# EAGLE design Adafruit PWM Servo Shield (EAGLE 6.3)
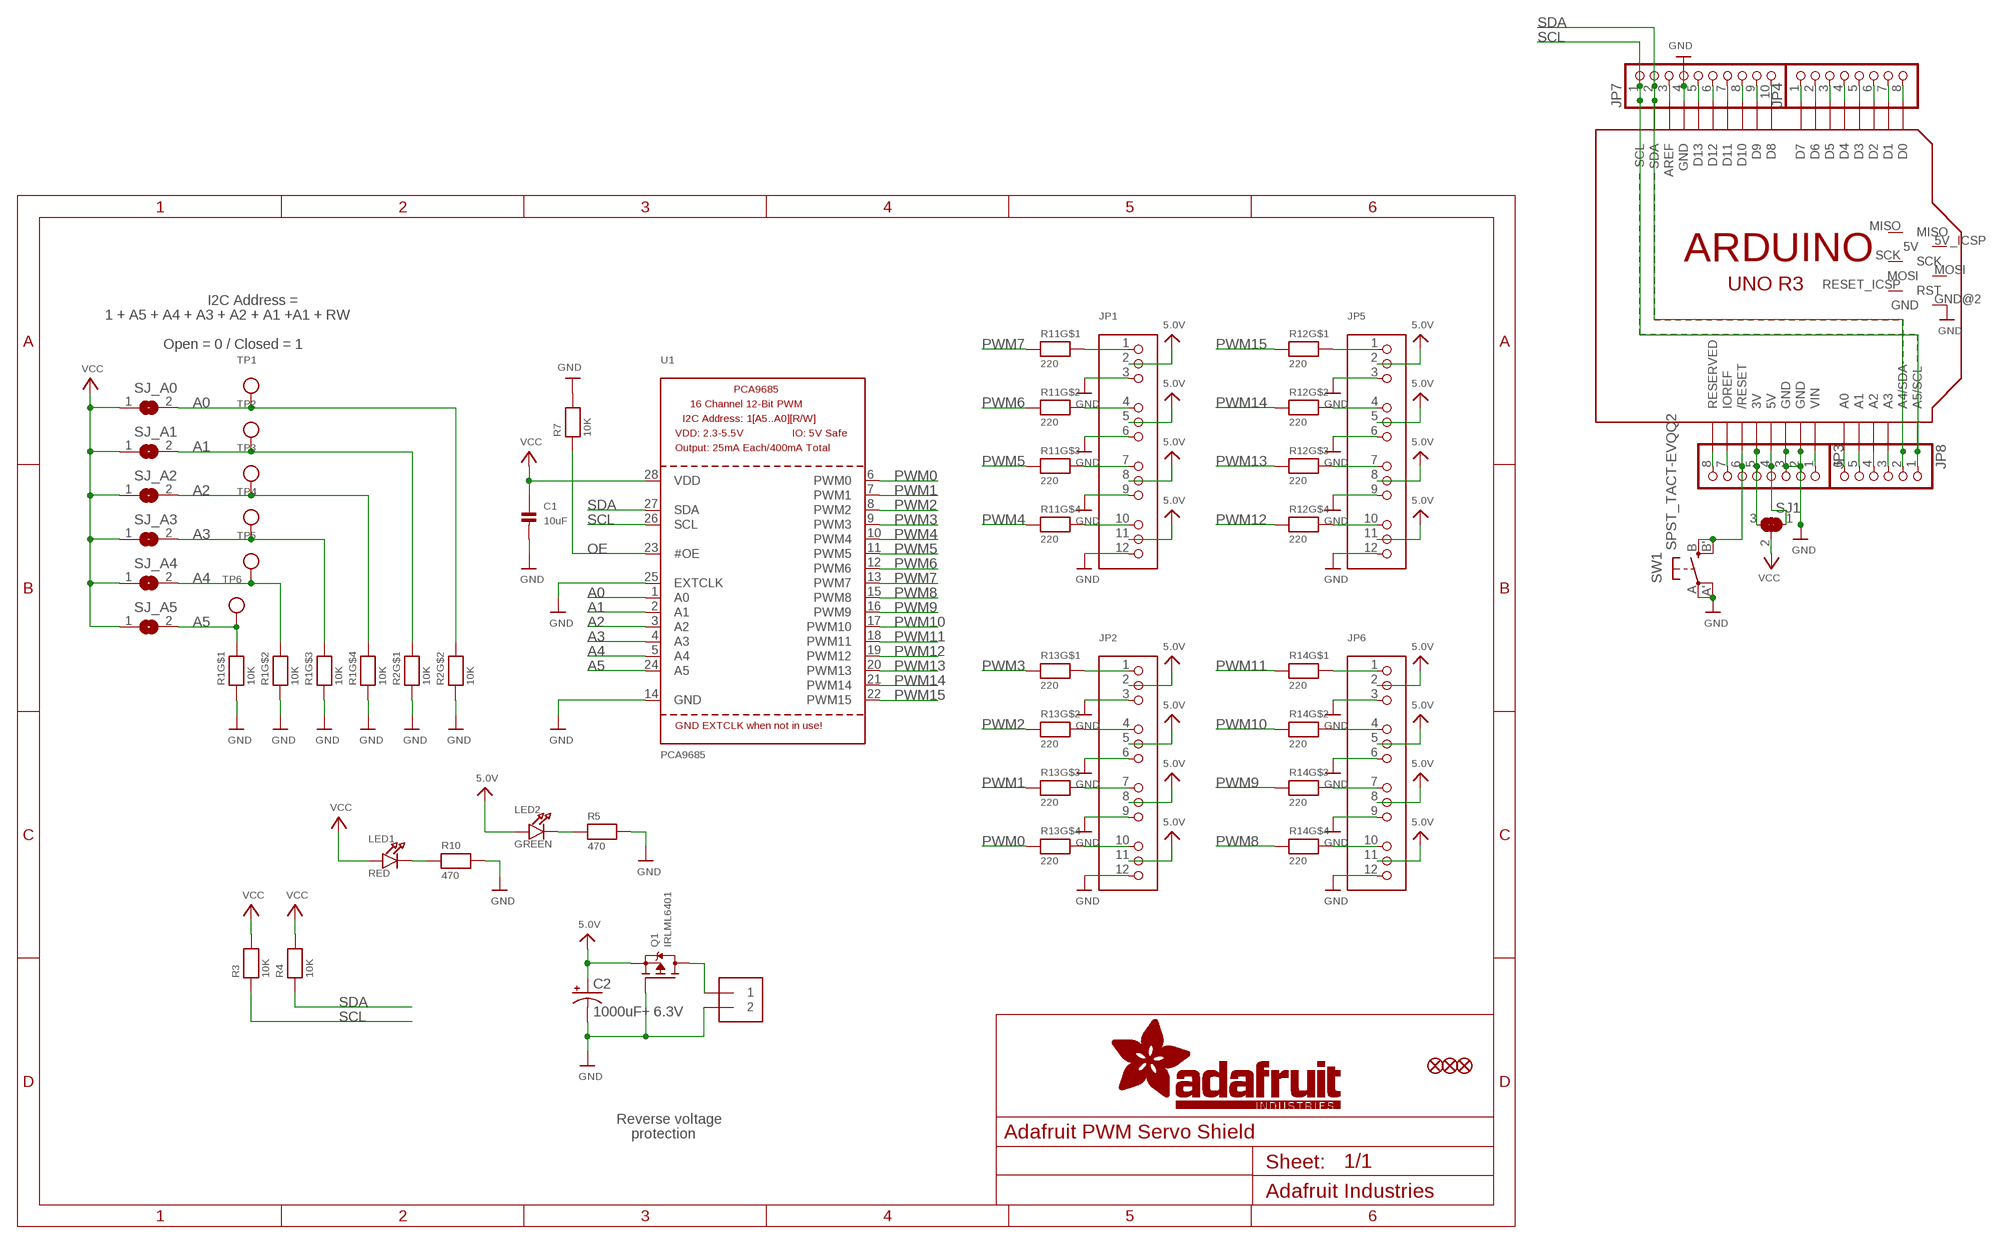
[diagram p0: schematic, sheet 1]

## Parts
C1  10uF  CAP_CERAMIC0805  [0805]
C2  1000uF+ 6.3V  CPOL-USE3.5-10  [E3,5-10]
FID1  FIDUCIAL""  [FIDUCIAL_1MM]
FID2  FIDUCIAL""  [FIDUCIAL_1MM]
FID3  FIDUCIAL""  [FIDUCIAL_1MM]
J1  TERMBLOCK_1X2-3.5MM  [1X2-3.5MM]
JP1  HEADER-3X04  [3X04]
JP2  HEADER-3X04  [3X04]
JP3  PINHD-1X8CLEANBIG  [1X08-CLEANBIG]
JP4  PINHD-1X8CLEANBIG  [1X08-CLEANBIG]
JP5  HEADER-3X04  [3X04]
JP6  HEADER-3X04  [3X04]
JP7  HEADER-1X1070MIL  [1X10_ROUND70]
JP8  PINHD-1X6CB  [1X06-CLEANBIG]
LED1  RED  LED0805  [CHIPLED_0805]
LED2  GREEN  LED0805  [CHIPLED_0805]
Q1  IRLML6401  MOSFET-PWIDE  [SOT23-WIDE]
R1  10K  RESISTOR_4PACK  [RESPACK_4X0603]
R2  10K  RESISTOR_4PACK  [RESPACK_4X0603]
R3  10K  RESISTOR0805  [0805]
R4  10K  RESISTOR0805  [0805]
R5  470  RESISTOR0805  [0805]
R7  10K  RESISTOR0805  [0805]
R10  470  RESISTOR0805  [0805]
R11  220  RESISTOR_4PACK  [RESPACK_4X0603]
R12  220  RESISTOR_4PACK  [RESPACK_4X0603]
R13  220  RESISTOR_4PACK  [RESPACK_4X0603]
R14  220  RESISTOR_4PACK  [RESPACK_4X0603]
SJ1  SOLDERJUMPER_2WAY  [SOLDERJUMPER_2WAY_OPEN_NOPASTE]
SJ_A0  SOLDERJUMPERREFLOW_NOPASTE  [SOLDERJUMPER_REFLOW_NOPASTE]
SJ_A1  SOLDERJUMPERREFLOW_NOPASTE  [SOLDERJUMPER_REFLOW_NOPASTE]
SJ_A2  SOLDERJUMPERREFLOW_NOPASTE  [SOLDERJUMPER_REFLOW_NOPASTE]
SJ_A3  SOLDERJUMPERREFLOW_NOPASTE  [SOLDERJUMPER_REFLOW_NOPASTE]
SJ_A4  SOLDERJUMPERREFLOW_NOPASTE  [SOLDERJUMPER_REFLOW_NOPASTE]
SJ_A5  SOLDERJUMPERREFLOW_NOPASTE  [SOLDERJUMPER_REFLOW_NOPASTE]
SW1  SPST_TACT-EVQQ2  [EVQ-Q2]
TP1  TESTPOINTROUND2MM  [TESTPOINT_ROUND_2MM]
TP2  TESTPOINTROUND2MM  [TESTPOINT_ROUND_2MM]
TP3  TESTPOINTROUND2MM  [TESTPOINT_ROUND_2MM]
TP4  TESTPOINTROUND2MM  [TESTPOINT_ROUND_2MM]
TP5  TESTPOINTROUND2MM  [TESTPOINT_ROUND_2MM]
TP6  TESTPOINTROUND2MM  [TESTPOINT_ROUND_2MM]
U1  PCA9685  [TSSOP28]
U$44  ARDUINO_R3_ICSP  [ARDUINOR3_ICSP]

## Nets
5.0V: C2.+ JP1.2 JP1.5 JP1.8 JP1.11 JP2.2 JP2.5 JP2.8 JP2.11 JP5.2 JP5.5 JP5.8 JP5.11 JP6.2 JP6.5 JP6.8 JP6.11 LED2.A Q1.2(S)
A0: R2.7 SJ_A0.2 TP1.P$1 U1.1(A0)
A1: R2.8 SJ_A1.2 TP2.P$1 U1.2(A1)
A2: R1.5 SJ_A2.2 TP3.P$1 U1.3(A2)
A3: R1.6 SJ_A3.2 TP4.P$1 U1.4(A3)
A4: R1.7 SJ_A4.2 TP5.P$1 U1.5(A4)
A5: R1.8 SJ_A5.2 TP6.P$1 U1.24(A5)
GND: C1.2 C2.- J1.2 JP1.3 JP1.6 JP1.9 JP1.12 JP2.3 JP2.6 JP2.9 JP2.12 JP3.2 JP3.3 JP5.3 JP5.6 JP5.9 JP5.12 JP6.3 JP6.6 JP6.9 JP6.12 JP7.4 Q1.1(G) R1.1 R1.2 R1.3 R1.4 R2.1 R2.2 R5.2 R7.2 R10.2 SW1.A'(P1) SW1.A(P) U1.14(GND) U1.25(EXTCLK) U$44.GND U$44.GND@1(GND) U$44.GND@2(GND) U$44.GND@3(GND)
N$1: LED1.C R10.1
N$2: JP1.4 R11.7
N$3: JP1.1 R11.8
N$4: JP1.7 R11.6
N$5: JP1.10 R11.5
N$6: JP2.1 R13.8
N$7: JP2.4 R13.7
N$8: JP2.7 R13.6
N$9: JP2.10 R13.5
N$10: JP6.10 R14.5
N$11: JP6.7 R14.6
N$12: JP6.4 R14.7
N$13: JP6.1 R14.8
N$14: JP5.10 R12.5
N$15: JP5.7 R12.6
N$16: JP5.4 R12.7
N$17: JP5.1 R12.8
N$18: JP3.1 U$44.VIN
N$19: LED2.C R5.1
N$22: JP3.5 SJ1.3 U$44.3V
N$23: JP3.4 SJ1.1 U$44.5V
N$24: JP3.7 U$44.IOREF
N$25: JP3.8 U$44.RESERVED
N$26: JP4.1 U$44.D7
N$27: JP4.2 U$44.D6
N$28: JP4.3 U$44.D5
N$29: JP4.4 U$44.D4
N$30: JP4.5 U$44.D3
N$31: JP4.6 U$44.D2
N$32: JP4.7 U$44.D1
N$33: JP4.8 U$44.D0
N$36: JP7.3 U$44.AREF
N$38: JP7.5 U$44.D13
N$39: JP7.6 U$44.D12
N$40: JP7.7 U$44.D11
N$41: JP7.8 U$44.D10
N$42: JP7.9 U$44.D9
N$43: JP7.10 U$44.D8
N$46: JP8.3 U$44.A3
N$47: JP8.4 U$44.A2
N$48: JP8.5 U$44.A1
N$49: JP8.6 U$44.A0
N$139: JP3.6 SW1.B'(S1) SW1.B(S) U$44.RESET(/RESET)
OE: R7.1 U1.23(#OE)
PWM0: R13.4 U1.6(PWM0)
PWM1: R13.3 U1.7(PWM1)
PWM2: R13.2 U1.8(PWM2)
PWM3: R13.1 U1.9(PWM3)
PWM4: R11.4 U1.10(PWM4)
PWM5: R11.3 U1.11(PWM5)
PWM6: R11.2 U1.12(PWM6)
PWM7: R11.1 U1.13(PWM7)
PWM8: R14.4 U1.15(PWM8)
PWM9: R14.3 U1.16(PWM9)
PWM10: R14.2 U1.17(PWM10)
PWM11: R14.1 U1.18(PWM11)
PWM12: R12.4 U1.19(PWM12)
PWM13: R12.3 U1.20(PWM13)
PWM14: R12.2 U1.21(PWM14)
PWM15: R12.1 U1.22(PWM15)
PWRIN: J1.1 Q1.3(D)
SCL: JP7.1 JP8.1 R3.1 U1.26(SCL) U$44.A5(A5/SCL) U$44.SCL
SDA: JP7.2 JP8.2 R4.1 U1.27(SDA) U$44.A4(A4/SDA) U$44.SDA
VCC: C1.1 LED1.A R3.2 R4.2 SJ1.2 SJ_A0.1 SJ_A1.1 SJ_A2.1 SJ_A3.1 SJ_A4.1 SJ_A5.1 U1.28(VDD)
Unconnected: R2.3 R2.4 R2.5 R2.6 U$44.5V_ICSP(5V) U$44.MISO U$44.MOSI U$44.RESET_ICSP(RST) U$44.SCK

## Notes on the sheet
- I2C Address =
- 1 + A5 + A4 + A3 + A2 + A1 +A1 + RW
- Open = 0 / Closed = 1
- Reverse voltage
- protection

## Library data of the parts
C1 = microbuilder:CAP_CERAMIC: Ceramic Capacitors 0402 - 0402 Surface Mount Capacitors 16pF 50V 5% [Digikey: 445-4899-2-ND] 18pF 50V 5% [Digikey: 490-1281-2-ND] 22pF 50V 5% [Digikey: 490-1283-2-ND] 68pF 50V 5% [Digikey: 490-1289-2-ND] 0.1uF 10V 10% [Digikey: 490-1318-2-ND] 1.0uF 6.3V 10% [Digikey: 490-1320-2-ND] 0603 - 0603 Surface Mount Capacitors 16 pF 50V 5% [Digikey: 445-5051-2-ND] 22 pF 50V [Digikey: PCC220ACVTR-ND] 33 pF 50V 5% [Digikey: 490-1415-1-ND] 56pF 50V 5% [Digikey: 490-1421-1-ND] 220pF 50V 5% [Digikey: 445-1285-1-ND] 680 pF 50V 2200 pF 50V 5% C0G [Digikey: 445-1297-1-ND] 5600 pF 100V 5% X7R [Digikey: 478-3711-1-ND] 0.1 µF 25V 10% [Digikey: PCC2277TR-ND] 0.22 µF 16V 10% X7R [Digikey: 445-1318-1-ND] 1.0 µF 25V 10% [Digikey: 445-5146-2-ND] 0603 - RF Specific 3pF 250V +/-0.1pF RF [Digikey: 712-1347-1-ND] 18 pF 250V 5% [Digikey: 478-3505-1-ND or 712-1322-1-ND] 56 pF 250V 5% C0G RF [Digikey: 490-4867-1-ND] 68 pF 250V RF [Digikey: 490-4868-1-ND] 0805 - 0805 Surface Mount Capacitors 220 pF 250V 2% RF Ceramic Capacitor [Digikey: 712-1398-1-ND] 1000 pF 50V 2% NP0 Ceramic Capacitor [Digikey: 478-3760-1-ND] 0.1 µF 25V 10% Ceramic Capacitor [Digikey: PCC1828TR-ND] 1.0 µF 16V 10% Ceramic Capacitor[Digikey: 490-1691-2-ND] 10.0 µF 10V 10% Ceramic Capacitor[Digikey: 709-1228-1-ND] 10.0 uF 16V 10% Ceramic Capacitor [Digikey: 478-5165-2-ND] 47 uF 6.3V 20% Ceramic Capacitor [Digikey: 587-1779-1-ND or 399-5506-1-ND] 1206 - 1206 Surface Mount Capacitors 47uF 10V 20% Ceramic Capacitor [Digikey: 490-5528-1-ND or 399-5508-1-ND or 445-6010-1-ND] 100uF 6.3V -20%, +80% Y5V Ceramic Capacitor (Digikey: 490-4512-1-ND, Mouser: 81-GRM31CF50J107ZE1L)
C2 = adafruit:CPOL-US: POLARIZED CAPACITOR, American symbol
FID1-FID3 = microbuilder:FIDUCIAL: Fiducial Alignment Points Various fiducial points for machine vision alignment.
J1 = microbuilder:TERMBLOCK_1X2: 3.5mm Terminal block http://www.ladyada.net/library/pcb/eaglelibrary.html
JP1 JP2 JP5 JP6 = microbuilder:HEADER-3X04
JP3 JP4 = adafruit:PINHD-1X8: PIN HEADER
JP7 = microbuilder:HEADER-1X10: PIN HEADER
JP8 = adafruit:PINHD-1X6: PIN HEADER
LED1 LED2 = microbuilder:LED: LED 0603 - 0603 Surface Mount Package 2mA: Green LED - Low Power (3.9mcd, 2ma, 1.7Vf) - Digikey: 475-2709-2-ND Orange LED - Low Power (9.8mcd, 2ma, 1.8Vf) - Digikey: 475-1194-2-ND Red LED - Low Power (5mcd, 2ma, 1.8Vf) - Digikey: 475-1195-2-ND Yellow LED - Low Power (7mcd, 2ma, 1.8Vf) - Digikey: 475-1196-2-ND 5mA: Blue LED - Low Power (17mcd, 5ma, 2.9Vf) - Digikey: LNJ937W8CRACT-ND 0805 - 0805 Surface Mount Package 2mA: Red LED (8.8mcd, 2mA, 1.8Vf, Clear) - Low Power [Digikey: 475-2510-1-ND] Green LED (5mcd, 2mA, 1.8Vf, Clear) - Low Power [Digikey: 475-2730-1-ND] Yellow LED (11.3mcd, 2mA, 1.8Vf, Clear) - Low Power [Digikey: 475-2555-1-ND] 20mA: Red LED (104mcd, 20mA, Diffused) - LS R976 [Digikey: 475-1278-6-ND] Red LED (12mcd, 20mA, 2.0Vf, Clear) - APT2012EC [Digikey: 754-1128-1-ND] Green LED (15mcd, 20mA, 2.2Vf, Clear) - APT2012GC [Digikey: 754-1131-1-ND] Orange LED (160mcd, 20mA, 2.1Vf, Clear) - APT2012SECK [Digikey: 754-1130-1-ND] 1206 - 1206 Surface Mount Package Green LED (26mcd, 20mA, Diffused) - LG N971 [Digikey: 475-1407-6-ND] Red LED (15mcd, 20mA, Diffused) - LH N974 [Digikey: 475-1416-6-ND]
Q1 = microbuilder:MOSFET-P: P-Channel Mosfet LEGEND VDS: Voltage Drain-Source ID: Drain Current RDS(ON): Drain-Source On-State Resistance VGS(TH): Gate-Source Threshold Voltage CISS: Drain-Source Input Capacitance SOT-23 Name VDS ID RDS(ON) VGS(TH) CISS Order Number IRLML5103 30V 760mA 600 mOhm -- 75pF @ 25V Digikey: IRLML5103PBFCT-ND NTR0202PL 20V 400mA 800 mOhm 2.3V @ 250uA 70pF @ 5V Digikey: NTR0202PLT1GOSTR-ND NTR4101PT1G 20V 1.8A 85 mOhm 1.2V @ 250uA 675pF @ 10V Digikey: NTR4101PT1GOSCT-ND DMP2004K 20V 600mA 900 mOhm 1V @ 250uA 175pF @ 16V Digikey: DMP2004KDICT-ND PMV65XP 20V 3.9A 76 mOhm 950mV @ 1mA 725pF @ 20V Digikey: 568-2358-2-ND TO-252 Name VDS ID RDS(ON) VGS(TH) CISS Order Number AOD417 30V 25A 34 mOhm 3V @ 250µA 920pF @ 15V Digikey: 785-1106-2-ND
R1 R2 R11-R14 = microbuilder:RESISTOR_4PACK: Resistor Packs (4 resistors) 4 x 0603 10K 1/16W - Digikey: YC164J-10KCT-ND
R3-R5 R7 R10 = microbuilder:RESISTOR: Resistors 0402 - 0402 Surface Mount Package 22 Ohm 1% 1/16W [Digikey: 311-22.0LRTR-ND] 33 Ohm 5% 1/16W 1.0K 5% 1/16W 1.5K 5% 1/16W 2.0K 1% 1/16W 10.0K 1% 1/16W [Digikey: 311-10.0KLRTR-ND] 10.0K 5% 1/16W [Digikey: RMCF0402JT10K0TR-ND] 12.1K 1% 1/16W [Digikey: 311-22.0LRTR-ND] 100.0K 5% 1/16W 0603 - 0603 Surface Mount Package 0 Ohm 1/10 Watt 1% Resistor 15 Ohm 1/10 Watt 1% Resistor 33 Ohm 1/10 Watt 1% Resistor 49.9 Ohm 1/10 Watt 1% Resistor 100 Ohm 1/10 Watt 1% Resistor 150 Ohm 1/10 Watt 1% Resistor 240 Ohm 1/10 Watt 1% Resistor 390 Ohm 1/10 Watt 1% Resistor 560 Ohm 1/10 Watt 1% Resistor 680 Ohm 1/10 Watt 1% Resistor 750 Ohm 1/10 Watt 1% Resistor 1.0K Ohm 1/10 Watt 1% Resistor 1.5K Ohm 1/10 Watt 1% Resistor 2.0K Ohm 1/10 Watt 1% Resistor 2.2K Ohm 1/10 Watt 1% Resistor 3.3K Ohm 1/10 Watt 1% Resistor 4.7K Ohm 1/10 Watt 1% Resistor 10.0K Ohm 1/10 Watt 1% Resistor 12.0K Ohm 1/10 Watt 1% Resistor 12.1K Ohm 1/10 Watt 1% Resistor 20.0K Ohm 1/10 Watt 1% Resistor 33.0K Ohm 1/10 Watt 1% Resistor 100.0K Ohm 1/10 Watt 1% Resistor 0805 - 0805 Surface Mount Package 0 Ohm 1/8 Watt 1% Resistor 33 Ohm 1/8 Watt 1% Resistor 100 Ohm 1/8 Watt 1% Resistor 150 Ohm 1/8 Watt 1% Resistor 200 Ohm 1/8 Watt 1% Resistor 240 Ohm 1/8 Watt 1% Resistor 330 Ohm 1/8 Watt 1% Resistor 390 Ohm 1/8 Watt 1% Resistor 470 Ohm 1/8 Watt 1% Resistor 1.0K Ohm 1/8 Watt 1% Resistor 1.5K Ohm 1/8 Watt 1% Resistor 2.0K Ohm 1/8 Watt 1% Resistor 4.7K Ohm 1/8 Watt 1% Resistor 5.1K Ohm 1/8 Watt 1% Resistor 5.6K Ohm 1/8 Watt 1% Resistor 10.0K Ohm 1/8 Watt 1% Resistor 22.0K Ohm 1/8 Watt 1% Resistor 33.0K Ohm 1/8 Watt 1% Resistor 100K Ohm 1/8 Watt 1% Resistor 1206 - 1206 Surface Mount Package 2012 - 2010 Surface Mount Package 0.11 Ohm 1/2 Watt 1% Resistor - Digikey: RHM.11UCT-ND
SJ1 = microbuilder:SOLDERJUMPER_2WAY: 2-Way Solder Jumper
SJ_A0 SJ_A1-SJ_A5 = microbuilder:SOLDERJUMPER: SMD Solder JUMPER Solder the two pads together to create a connection, or remove the solder to break it. REFLOW - Use this footprint for solder paste and reflow ovens. WAVE - Use this footprint for hand-soldering (larger pads). CLOSED - Has a trace between the two pads to ensure it is closed by default. The trace needs to be cut to disable the jumper, and can be closed again by creating a solder bridge between the two pads.
SW1 = adafruit:SPST_TACT: SMT 6mm switch, EVQQ2 series http://www.ladyada.net/library/eagle
TP1-TP6 = microbuilder:TESTPOINT: Test Point Various test points for characterisation and PCB testing TESTPOINT_SMT - Compact Surface Mount Test Point [Digikey: 5016KTR-ND]
U1 = microbuilder:PCA9685: PCA9685 - 16 Channel 12-Bit I2C PWM Controller 5.0V tolerant 16 channel, 12-bit I2C PWM controller with 25mA per output (max. 400mA total) Digikey: 568-5931-1-ND
U$44 = adafruit:ARDUINO_R3_ICSP

## Board
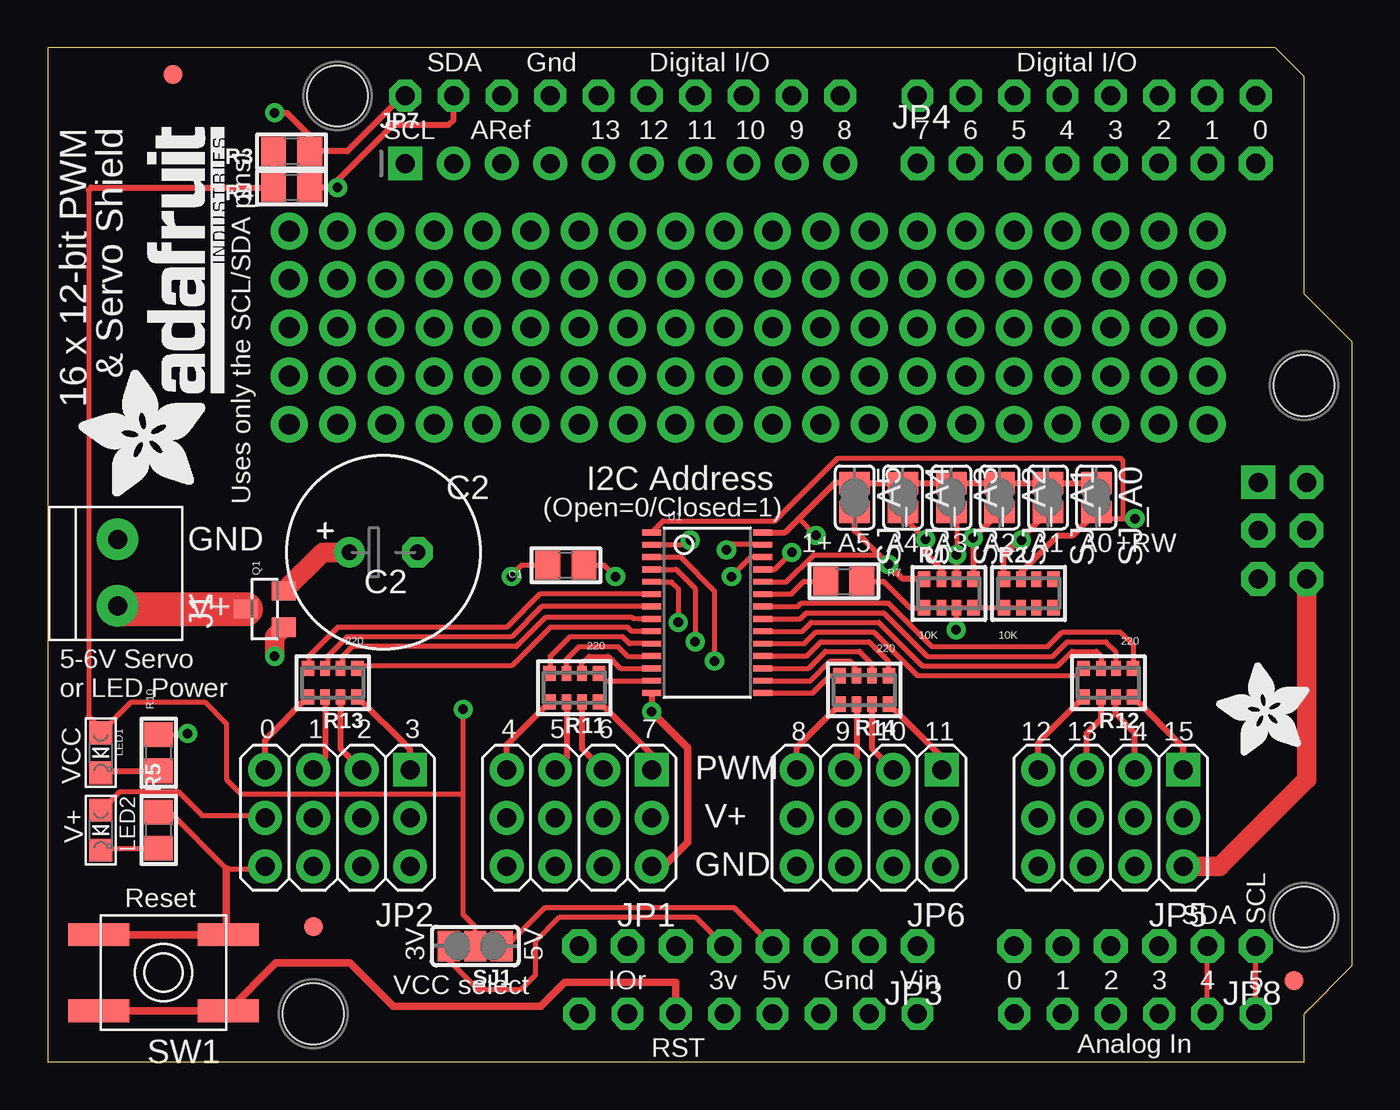
[diagram p1: board, top side]
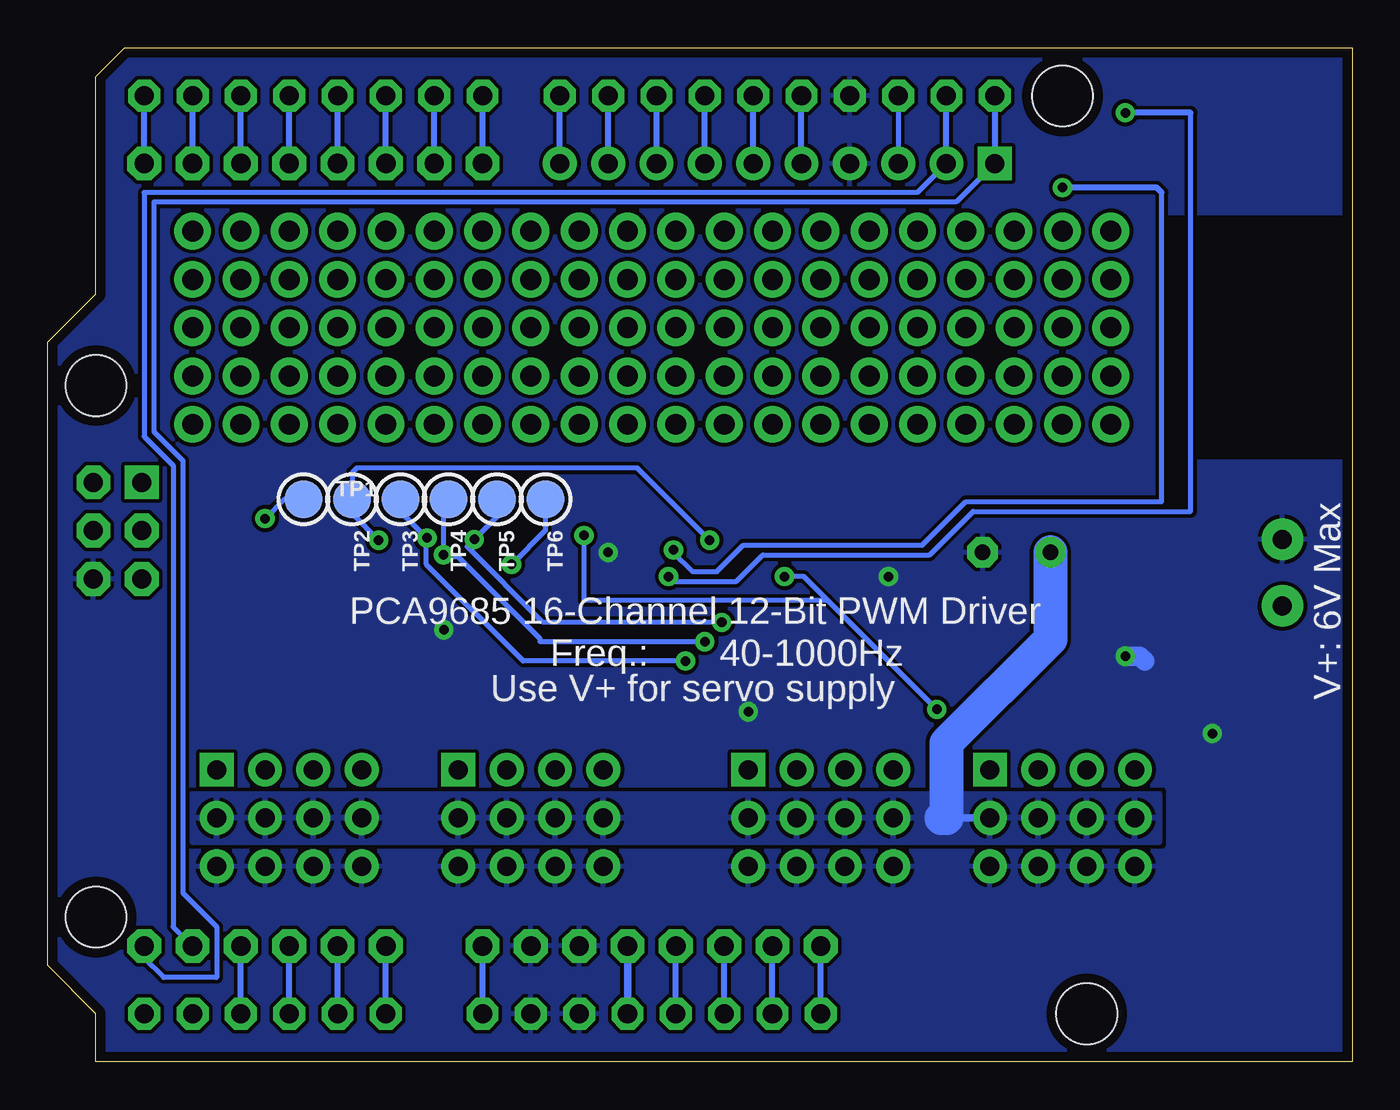
[diagram p2: board, bottom side, seen from below]

Size 68.58 x 53.34 mm. Coordinates in mm from the lower left corner, seen from the top.
Copper layers (1*16): Top 0.035mm / dielectric 1.5mm / Bottom 0.035mm
Design rules "PCBCart-Standard *": minimum track width 8mil, minimum drill 0.4mm, track to track 8mil, track to pad 8mil, pad to pad 8mil, via to via 8mil, smd to smd 8mil, copper to edge 20mil, drill to drill 8mil, minimum pad ring 8mil, minimum via ring 10mil, stop-mask expansion 3mil, vias tented up to drill 20mil, thermal gap 8mil
Holes 3.2 mm at 15.24,50.8 66.04,35.56 66.04,7.62 13.97,2.54

### Footprints (pad centres in the part's own frame; a part is rotated, then mirrored left to right if it is on the bottom)
0805 = smd 1.3 x 1.5: 1 -0.95,0; 2 0.95,0
E3,5-10 = drill 0.813 pad 1.6: + -1.778,0 | drill 0.813 pad 1.6 octagon: - 1.778,0
FIDUCIAL_1MM = smd 1 x 1: 1 0,0
1X2-3.5MM = drill 1 pad 2.184: 1 1.8,0; 2 -1.7,0
3X04 = drill 1 pad 1.778 square: 1 -3.81,-2.54 | drill 1 pad 1.778: 2 -3.81,0; 3 -3.81,2.54; 4 -1.27,-2.54; 5 -1.27,0; 6 -1.27,2.54; 7 1.27,-2.54; 8 1.27,0; 9 1.27,2.54; 10 3.81,-2.54; 11 3.81,0; 12 3.81,2.54
1X08-CLEANBIG = drill 1.016 pad 1.778 octagon: 1 -8.89,0; 2 -6.35,0; 3 -3.81,0; 4 -1.27,0; 5 1.27,0; 6 3.81,0; 7 6.35,0; 8 8.89,0
1X10_ROUND70 = drill 1 pad 1.778 square: 1 -11.43,0 | drill 1 pad 1.778: 2 -8.89,0; 3 -6.35,0; 4 -3.81,0; 5 -1.27,0; 6 1.27,0; 7 3.81,0; 8 6.35,0; 9 8.89,0; 10 11.43,0
1X06-CLEANBIG = drill 1.016 pad 1.778 octagon: 1 -6.35,0; 2 -3.81,0; 3 -1.27,0; 4 1.27,0; 5 3.81,0; 6 6.35,0
CHIPLED_0805 = smd 1.2 x 1.2: A 0,-1.05; C 0,1.05
SOT23-WIDE = smd 1 x 1.27: 1 -0.95,-1; 2 0.95,-1; 3 0,1
RESPACK_4X0603 = smd 0.65 x 0.8: 1 -1.3,-0.75; 4 1.3,-0.75; 5 1.3,0.75; 8 -1.3,0.75 | smd 0.5 x 0.8: 2 -0.4,-0.75; 3 0.4,-0.75; 6 0.4,0.75; 7 -0.4,0.75
SOLDERJUMPER_2WAY_OPEN_NOPASTE = smd 1.168 x 1.6: 1 -1.397,0; 2 0,0; 3 1.397,0
SOLDERJUMPER_REFLOW_NOPASTE = smd 1.168 x 1.6: 1 -0.762,0; 2 0.762,0
EVQ-Q2 = smd 3.2 x 1.2: A -3.4,-2; A' 3.4,-2; B -3.4,2; B' 3.4,2
TESTPOINT_ROUND_2MM = smd 2 x 2: P$1 0,0
TSSOP28 = smd 0.305 x 0.991: 1 -4.225,-2.918; 2 -3.575,-2.918; 3 -2.925,-2.918; 4 -2.275,-2.918; 5 -1.625,-2.918; 6 -0.975,-2.918; 7 -0.325,-2.918; 8 0.325,-2.918; 9 0.975,-2.918; 10 1.625,-2.918; 11 2.275,-2.918; 12 2.925,-2.918; 13 3.575,-2.918; 14 4.225,-2.918; 15 4.225,2.918; 16 3.575,2.918; 17 2.925,2.918; 18 2.275,2.918; 19 1.625,2.918; 20 0.975,2.918; 21 0.325,2.918; 22 -0.325,2.918; 23 -0.975,2.918; 24 -1.625,2.918; 25 -2.275,2.918; 26 -2.925,2.918; 27 -3.575,2.918; 28 -4.225,2.918
ARDUINOR3_ICSP = drill 1 pad 1.676 octagon: 3V 35.56,2.54; 5V 38.1,2.54; A0 50.8,2.54; A1 53.34,2.54; A2 55.88,2.54; A3 58.42,2.54; A4 60.96,2.54; A5 63.5,2.54; AREF 23.876,50.8; D0 63.5,50.8; D1 60.96,50.8; D2 58.42,50.8; D3 55.88,50.8; D4 53.34,50.8; D5 50.8,50.8; D6 48.26,50.8; D7 45.72,50.8; D8 41.656,50.8; D9 39.116,50.8; D10 36.576,50.8; D11 34.036,50.8; D12 31.496,50.8; D13 28.956,50.8; GND 26.416,50.8; GND@1 43.18,2.54; GND@2 40.64,2.54; IOREF 30.48,2.54; RESERVED 27.94,2.54; RESET 33.02,2.54; SCL 18.796,50.8; SDA 21.336,50.8; VIN 45.72,2.54 | drill 1 pad 1.778 octagon: 5V_ICSP 66.167,30.48; GND@3 66.167,25.4; MOSI 66.167,27.94; RESET_ICSP 63.627,25.4; SCK 63.627,27.94 | drill 1 pad 1.778 square: MISO 63.627,30.48

### Placement (x,y rotation side)
C1  27.24,26.11 180 top
C2  17.65,26.8 0 top
FID1  65.52,4.29 0 top
FID2  6.6,51.92 0 top
FID3  13.97,7.11 0 top
J1  3.68,25.78 270 top
JP1  27.94,12.83 180 top
JP2  15.24,12.83 180 top
JP3  36.83,6.1 180 top
JP4  54.61,47.24 0 top
JP5  55.88,12.83 180 top
JP6  43.18,12.83 180 top
JP7  30.23,47.24 0 top
JP8  57.15,6.1 180 top
LED1  2.79,16.26 180 top
LED2  2.79,12.19 180 top
Q1  11.42,23.81 90 top
R1  47.37,24.64 0 top
R2  51.56,24.64 0 top
R3  12.83,47.88 180 top
R4  12.83,45.97 180 top
R5  5.84,12.19 90 top
R7  41.85,25.27 0 top
R10  5.84,16.26 90 top
R11  27.69,19.68 180 top
R12  55.75,19.94 180 top
R13  14.99,19.94 180 top
R14  42.93,19.56 180 top
SJ1  22.48,6.1 180 top
SJ_A0  55.12,29.69 270 top
SJ_A1  52.58,29.69 270 top
SJ_A2  50.04,29.69 270 top
SJ_A3  47.5,29.69 270 top
SJ_A4  44.96,29.69 270 top
SJ_A5  42.42,29.69 270 top
SW1  6.1,4.7 180 top
TP1  55.12,29.59 0 bottom
TP2  52.58,29.59 270 bottom
TP3  50.04,29.59 270 bottom
TP4  47.5,29.59 270 bottom
TP5  44.96,29.59 270 bottom
TP6  42.42,29.59 270 bottom
U1  34.67,23.62 270 top
U$44  0,0 0 top
U$51  [ADAFRUIT_5MM]  66.29,16.13 90 top
U$54  [ADAFRUIT_TEXT_20MM]  9.27,29.59 90 top

### Tracks (layer width: path | path; a pad name or v marks a point on that pad's centre or on a via)
5.0V
  Top 0.254: LED2.A 2.83,13.24 3.81,14.22 6.86,14.22 8.13,12.95 11.3,12.95 JP2.11
  Top 1.016: Q1.2 14.45,26.8 C2.+
  Bottom 0.406: 21.59,12.83 JP2.2
  Bottom 1.778: C2.+ 15.88,22.23 21.34,16.76 21.34,12.83 21.59,12.83
  pour Bottom: 10.16,14.1 10.16,11.56 60.96,11.56 60.96,14.1
A0  (via drill 0.5)
  Top 0.254: U1.1 32.35,28.45 38.23,28.45 41.53,31.75 56.39,31.75 56.52,31.62 56.52,28.56 | 56.52,28.56 54.75,28.56 | v57.15,28.57 v57.15,28.56 56.52,28.56
  Top 0.305: R2.7 51.16,25.76 53.09,27.69 53.88,27.69 54.75,28.56 SJ_A0.2
  Bottom 0.254: TP1.P$1 56.13,29.59 v57.15,28.57
A1  (via drill 0.5)
  Top 0.254: U1.2 33.51,27.2 33.74,27.43 v33.78,27.43 | 51.29,27.67 51.32,27.67
  Top 0.305: R2.8 50.26,26.64 51.05,27.43 v51.18,27.43 51.32,27.57 51.32,27.67 SJ_A1.2
  Bottom 0.254: v51.18,27.43 52.58,28.83 TP2.P$1 52.58,30.99 52.32,31.24 37.59,31.24 v33.78,27.43
A2  (via drill 0.5)
  Top 0.254: U1.3 33.27,26.55 35.05,24.77 v35.05,21.08
  Top 0.305: R1.5 48.67,27.56 SJ_A2.2 50.01,28.92 v48.64,27.56
  Bottom 0.254: v35.05,21.08 43.59,21.08 48.67,26.16 48.67,27.53 v48.64,27.56 50.04,28.96 TP3.P$1
A3  (via drill 0.5)
  Top 0.254: U1.4 33.03,25.9 34.04,24.89 v34.04,22.1 | SJ_A3.2 47.77,28.65 v47.77,26.67
  Top 0.305: R1.6 v47.77,26.67
  Bottom 0.254: v34.04,22.1 42.69,22.1 42.69,22.24 46.99,26.54 47.64,26.54 v47.77,26.67 47.77,29.32 TP4.P$1
A4  (via drill 0.5)
  Top 0.254: U1.5 32.79,25.25 33.15,24.89 v33.15,23.11 | v46.15,27.48 44.96,28.67 SJ_A4.2
  Top 0.305: 46.97,25.77 R1.7 46.99,25.41 46.99,25.91 46.15,26.75 v46.15,27.48
  Bottom 0.254: v33.15,23.11 42.55,23.11 46.53,27.1 v46.15,27.48 44.96,28.67 TP5.P$1
A5  (via drill 0.5)
  Top 0.254: U1.24 38.84,25.25 40.26,26.67 43.69,26.67
  Top 0.305: SJ_A5.2 42.42,27.94 43.69,26.67 v44.2,26.16 44.93,25.43 46.03,25.43 R1.8
  Bottom 0.254: TP6.P$1 42.42,27.94 v44.2,26.16 44.45,26.16
GND  (via drill 0.5)
  Top 0.254: R5.2 6.42,13.14 9.4,10.16 11.3,10.16 JP2.12 | R10.2 7.3,17.21 v7.37,17.27 | U1.25 38.22,25.9 v39.12,26.8 | 47.75,23.89 R1.2 R1.1 46.06,23.88 45.34,23.88 43.94,25.27 R7.2 | 47.75,23.89 R1.3 R1.4 R2.1 R2.2 | 47.75,23.89 v47.75,22.73 | C1.2 24.89,26.11 24.38,25.61 v24.38,25.53
  Top 0.305: U1.14 v31.75,18.42 v31.75,18.41
  Top 0.406: SW1.A' SW1.A 9.4,6.8 9.4,10.16 | v31.75,18.42 33.66,16.52 33.66,11.56 32.38,10.29 JP1.3
  Top 1.016: Q1.1 11.94,22.38 v11.94,21.34 | U$44.GND@3 66.17,14.86 61.59,10.29 JP5.3
  Bottom 0.254: v7.37,17.27 7.49,17.4 | v31.75,18.41 31.75,18.54 | 47.88,22.99 47.88,22.48
  Bottom 1.016: v11.94,21.34 11.18,21.34 10.92,21.08
  pour Bottom (rank 3): 0,53.09 0,0 69.85,0 69.85,53.09
N$1
  Top 0.305: LED1.C 2.89,15.31 R10.1
N$2
  Top 0.305: R11.7 28.09,16.49 JP1.4
N$3
  Top 0.305: JP1.1 31.75,16.17 R11.8
N$4
  Top 0.305: R11.6 27.29,15.98 JP1.7
N$5
  Top 0.305: JP1.10 24.13,16.68 R11.5
N$6
  Top 0.305: JP2.1 19.05,16.43 R13.8
N$7
  Top 0.305: R13.7 15.39,16.49 JP2.4
N$8
  Top 0.305: R13.6 14.59,15.98 JP2.7
N$9
  Top 0.305: JP2.10 11.43,16.93 R13.5
N$10
  Top 0.305: JP6.10 39.37,16.55 R14.5
N$11
  Top 0.305: R14.6 42.53,15.98 JP6.7
N$12
  Top 0.305: R14.7 43.33,16.49 JP6.4
N$13
  Top 0.305: R14.8 46.99,16.04 JP6.1
N$14
  Top 0.305: JP5.10 52.07,16.81 R12.5
N$15
  Top 0.305: JP5.7 54.61,17.27 55.37,18.03 55.37,19.17 R12.6
N$16
  Top 0.305: JP5.4 57.15,17.27 56.13,18.29 56.13,19.17 R12.7
N$17
  Top 0.305: JP5.1 59.69,16.55 R12.8
N$18
  Bottom 0.305: U$44.VIN JP3.1
N$19
  Top 0.254: LED2.C 2.89,11.24 R5.1
N$20  (via drill 1.1 pad 1.93)
  other vias: 17.78,36.07
N$22
  Top 0.254: SJ1.3 21.08,5.33 22.61,3.81 24.89,3.81 25.65,4.57 25.65,6.35 26.92,7.62 34.04,7.62 JP3.5
  Bottom 0.305: U$44.3V JP3.5
N$23
  Top 0.254: JP3.4 36.07,8.13 26.16,8.13 24.13,6.1 SJ1.1 22.48,6.1
  Bottom 0.406: U$44.5V JP3.4
N$24
  Bottom 0.305: U$44.IOREF JP3.7
N$25
  Bottom 0.305: U$44.RESERVED JP3.8
N$26
  Bottom 0.305: JP4.1 U$44.D7
N$27
  Bottom 0.305: JP4.2 U$44.D6
N$28
  Bottom 0.305: JP4.3 U$44.D5
N$29
  Bottom 0.305: JP4.4 U$44.D4
N$30
  Bottom 0.305: JP4.5 U$44.D3
N$31
  Bottom 0.305: JP4.6 U$44.D2
N$32
  Bottom 0.305: JP4.7 U$44.D1
N$33
  Bottom 0.305: JP4.8 U$44.D0
N$34  (via drill 1.1 pad 1.93)
  other vias: 15.24,33.53
N$35  (via drill 1.1 pad 1.93)
  other vias: 17.78,33.53
N$36
  Bottom 0.254: U$44.AREF JP7.3
N$37  (via drill 1.1 pad 1.93)
  other vias: 17.78,38.61
N$38
  Bottom 0.305: JP7.5 U$44.D13
N$39
  Bottom 0.305: JP7.6 U$44.D12
N$40
  Bottom 0.305: JP7.7 U$44.D11
N$41
  Bottom 0.305: JP7.8 U$44.D10
N$42
  Bottom 0.305: JP7.9 U$44.D9
N$43
  Bottom 0.305: JP7.10 U$44.D8
N$44  (via drill 1.1 pad 1.93)
  other vias: 15.24,36.07
N$45  (via drill 1.1 pad 1.93)
  other vias: 15.24,38.61
N$46
  Bottom 0.305: U$44.A3 JP8.3
N$47
  Bottom 0.305: U$44.A2 JP8.4
N$48
  Bottom 0.305: U$44.A1 JP8.5
N$49
  Bottom 0.305: U$44.A0 JP8.6
N$50  (via drill 1.1 pad 1.93)
  other vias: 15.24,41.15
N$51  (via drill 1.1 pad 1.93)
  other vias: 17.78,41.15
N$52  (via drill 1.1 pad 1.93)
  other vias: 17.78,43.69
N$53  (via drill 1.1 pad 1.93)
  other vias: 15.24,43.69
N$54  (via drill 1.1 pad 1.93)
  other vias: 20.32,43.69
N$55  (via drill 1.1 pad 1.93)
  other vias: 20.32,41.15
N$56  (via drill 1.1 pad 1.93)
  other vias: 20.32,38.61
N$57  (via drill 1.1 pad 1.93)
  other vias: 20.32,36.07
N$58  (via drill 1.1 pad 1.93)
  other vias: 20.32,33.53
N$59  (via drill 1.1 pad 1.93)
  other vias: 22.86,33.53
N$60  (via drill 1.1 pad 1.93)
  other vias: 22.86,36.07
N$61  (via drill 1.1 pad 1.93)
  other vias: 22.86,38.61
N$62  (via drill 1.1 pad 1.93)
  other vias: 22.86,41.15
N$63  (via drill 1.1 pad 1.93)
  other vias: 22.86,43.69
N$64  (via drill 1.1 pad 1.93)
  other vias: 25.4,43.69
N$65  (via drill 1.1 pad 1.93)
  other vias: 25.4,41.15
N$66  (via drill 1.1 pad 1.93)
  other vias: 25.4,38.61
N$67  (via drill 1.1 pad 1.93)
  other vias: 25.4,36.07
N$68  (via drill 1.1 pad 1.93)
  other vias: 25.4,33.53
N$69  (via drill 1.1 pad 1.93)
  other vias: 27.94,33.53
N$70  (via drill 1.1 pad 1.93)
  other vias: 27.94,36.07
N$71  (via drill 1.1 pad 1.93)
  other vias: 27.94,38.61
N$72  (via drill 1.1 pad 1.93)
  other vias: 27.94,41.15
N$73  (via drill 1.1 pad 1.93)
  other vias: 27.94,43.69
N$74  (via drill 1.1 pad 1.93)
  other vias: 30.48,43.69
N$75  (via drill 1.1 pad 1.93)
  other vias: 30.48,41.15
N$76  (via drill 1.1 pad 1.93)
  other vias: 30.48,38.61
N$77  (via drill 1.1 pad 1.93)
  other vias: 30.48,36.07
N$78  (via drill 1.1 pad 1.93)
  other vias: 30.48,33.53
N$79  (via drill 1.1 pad 1.93)
  other vias: 33.02,33.53
N$80  (via drill 1.1 pad 1.93)
  other vias: 33.02,36.07
N$81  (via drill 1.1 pad 1.93)
  other vias: 33.02,38.61
N$82  (via drill 1.1 pad 1.93)
  other vias: 33.02,41.15
N$83  (via drill 1.1 pad 1.93)
  other vias: 33.02,43.69
N$84  (via drill 1.1 pad 1.93)
  other vias: 35.56,43.69
N$85  (via drill 1.1 pad 1.93)
  other vias: 38.1,43.69
N$86  (via drill 1.1 pad 1.93)
  other vias: 40.64,43.69
N$87  (via drill 1.1 pad 1.93)
  other vias: 43.18,43.69
N$88  (via drill 1.1 pad 1.93)
  other vias: 45.72,43.69
N$89  (via drill 1.1 pad 1.93)
  other vias: 48.26,43.69
N$90  (via drill 1.1 pad 1.93)
  other vias: 50.8,43.69
N$91  (via drill 1.1 pad 1.93)
  other vias: 53.34,41.15
N$92  (via drill 1.1 pad 1.93)
  other vias: 55.88,41.15
N$93  (via drill 1.1 pad 1.93)
  other vias: 58.42,41.15
N$94  (via drill 1.1 pad 1.93)
  other vias: 60.96,41.15
N$95  (via drill 1.1 pad 1.93)
  other vias: 60.96,33.53
N$96  (via drill 1.1 pad 1.93)
  other vias: 60.96,36.07
N$97  (via drill 1.1 pad 1.93)
  other vias: 60.96,38.61
N$98  (via drill 1.1 pad 1.93)
  other vias: 58.42,38.61
N$99  (via drill 1.1 pad 1.93)
  other vias: 58.42,36.07
N$100  (via drill 1.1 pad 1.93)
  other vias: 58.42,33.53
N$101  (via drill 1.1 pad 1.93)
  other vias: 55.88,33.53
N$102  (via drill 1.1 pad 1.93)
  other vias: 55.88,36.07
N$103  (via drill 1.1 pad 1.93)
  other vias: 55.88,38.61
N$104  (via drill 1.1 pad 1.93)
  other vias: 53.34,38.61
N$105  (via drill 1.1 pad 1.93)
  other vias: 53.34,36.07
N$106  (via drill 1.1 pad 1.93)
  other vias: 53.34,33.53
N$107  (via drill 1.1 pad 1.93)
  other vias: 50.8,33.53
N$108  (via drill 1.1 pad 1.93)
  other vias: 50.8,36.07
N$109  (via drill 1.1 pad 1.93)
  other vias: 50.8,38.61
N$110  (via drill 1.1 pad 1.93)
  other vias: 50.8,41.15
N$111  (via drill 1.1 pad 1.93)
  other vias: 48.26,41.15
N$112  (via drill 1.1 pad 1.93)
  other vias: 48.26,38.61
N$113  (via drill 1.1 pad 1.93)
  other vias: 48.26,36.07
N$114  (via drill 1.1 pad 1.93)
  other vias: 48.26,33.53
N$115  (via drill 1.1 pad 1.93)
  other vias: 45.72,33.53
N$116  (via drill 1.1 pad 1.93)
  other vias: 45.72,36.07
N$117  (via drill 1.1 pad 1.93)
  other vias: 45.72,38.61
N$118  (via drill 1.1 pad 1.93)
  other vias: 45.72,41.15
N$119  (via drill 1.1 pad 1.93)
  other vias: 43.18,41.15
N$120  (via drill 1.1 pad 1.93)
  other vias: 43.18,38.61
N$121  (via drill 1.1 pad 1.93)
  other vias: 43.18,36.07
N$122  (via drill 1.1 pad 1.93)
  other vias: 43.18,33.53
N$123  (via drill 1.1 pad 1.93)
  other vias: 40.64,33.53
N$124  (via drill 1.1 pad 1.93)
  other vias: 40.64,36.07
N$125  (via drill 1.1 pad 1.93)
  other vias: 40.64,38.61
N$126  (via drill 1.1 pad 1.93)
  other vias: 40.64,41.15
N$127  (via drill 1.1 pad 1.93)
  other vias: 38.1,41.15
N$128  (via drill 1.1 pad 1.93)
  other vias: 38.1,38.61
N$129  (via drill 1.1 pad 1.93)
  other vias: 38.1,36.07
N$130  (via drill 1.1 pad 1.93)
  other vias: 38.1,33.53
N$131  (via drill 1.1 pad 1.93)
  other vias: 35.56,33.53
N$132  (via drill 1.1 pad 1.93)
  other vias: 35.56,36.07
N$133  (via drill 1.1 pad 1.93)
  other vias: 35.56,38.61
N$134  (via drill 1.1 pad 1.93)
  other vias: 35.56,41.15
N$135  (via drill 1.1 pad 1.93)
  other vias: 53.34,43.69
N$136  (via drill 1.1 pad 1.93)
  other vias: 55.88,43.69
N$137  (via drill 1.1 pad 1.93)
  other vias: 58.42,43.69
N$138  (via drill 1.1 pad 1.93)
  other vias: 60.96,43.69
N$139
  Top 0.406: SW1.B' SW1.B 12,5.21 15.88,5.21 18.16,2.92 25.91,2.92 27.18,4.19 33.02,4.19 U$44.RESET
  Bottom 0.305: U$44.RESET JP3.6
N$164  (via drill 1.1 pad 1.93)
  other vias: 12.7,33.53
N$165  (via drill 1.1 pad 1.93)
  other vias: 12.7,36.07
N$166  (via drill 1.1 pad 1.93)
  other vias: 12.7,38.61
N$167  (via drill 1.1 pad 1.93)
  other vias: 12.7,41.15
N$168  (via drill 1.1 pad 1.93)
  other vias: 12.7,43.69
OE
  Top 0.254: U1.23 39.08,24.6 39.75,25.27 R7.1
PWM0
  Top 0.254: U1.6 25.87,24.6 24.13,22.86 15.24,22.86 13.72,21.34 13.72,20.72 R13.4
PWM1
  Top 0.254: U1.7 25.98,23.95 24.38,22.35 15.75,22.35 14.73,21.34 14.73,20.84 R13.3
PWM2
  Top 0.254: U1.8 30.8,23.3 30.73,23.37 26.16,23.37 24.64,21.84 16,21.84 15.49,21.34 15.49,20.8 R13.2
PWM3
  Top 0.254: U1.9 30.69,22.65 30.48,22.86 26.42,22.86 24.38,20.83 16.43,20.83 R13.1
PWM4
  Top 0.254: U1.10 30.58,22 30.23,22.35 27.43,22.35 26.42,21.34 26.42,20.46 R11.4
PWM5
  Top 0.254: R11.3 27.29,21.19 27.94,21.84 29.97,21.84 30.48,21.34 31.74,21.34 U1.11
PWM6
  Top 0.254: R11.2 28.09,20.97 28.45,21.34 29.46,21.34 30.1,20.7 U1.12
PWM7
  Top 0.254: R11.1 29.37,20.05 U1.13
PWM8
  Top 0.254: U1.15 40.23,19.4 41.15,20.32 41.61,20.32 R14.4
PWM9
  Top 0.254: U1.16 40.11,20.05 41.15,21.08 42.16,21.08 42.42,20.83 42.42,20.42 R14.3
PWM10
  Top 0.254: U1.17 40,20.7 40.89,21.59 42.67,21.59 43.33,20.94 R14.2
PWM11
  Top 0.254: U1.18 39.89,21.35 40.64,22.1 43.18,22.1 44.2,21.08 44.2,20.34 R14.1
PWM12
  Top 0.254: U1.19 39.78,22 40.39,22.61 43.43,22.61 45.72,20.32 54.08,20.32 R12.4
PWM13
  Top 0.254: U1.20 39.66,22.65 40.13,23.11 43.69,23.11 45.97,20.83 53.09,20.83 53.85,21.59 55.12,21.59 55.37,21.34 55.37,20.71 R12.3
PWM14
  Top 0.254: U1.21 39.55,23.3 39.88,23.62 43.94,23.62 46.23,21.34 52.83,21.34 53.59,22.1 55.63,22.1 56.13,21.59 56.13,20.71 R12.2
PWM15
  Top 0.254: U1.22 39.44,23.95 39.62,24.13 44.2,24.13 46.48,21.84 52.58,21.84 53.34,22.61 56.39,22.61 57.05,21.94 R12.1
PWRIN
  Top 1.016: J1.1 3.85,23.81
  Top 1.778: 3.85,23.81 Q1.3
SCL  (via drill 0.5)
  Top 0.254: U$44.A5 JP8.1 | U1.26 36.96,26.55 v35.94,25.53
  Top 0.305: U$44.SCL 18.67,50.8 15.75,47.88 R3.1 13.78,48.71 12.57,49.91 v11.94,49.91
  Bottom 0.254: JP7.1 20.83,45.21 62.99,45.21 62.99,33.15 61.47,31.62 61.47,8.89 59.69,7.11 59.69,4.45 62.48,4.45 63.5,5.46 JP8.1 | v35.94,25.53 35.69,25.27 32.38,25.27 30.99,26.67 22.23,26.67 19.94,28.96 8.51,28.96 8.51,49.91
  Bottom 0.305: U$44.SCL JP7.1 | 8.51,49.91 v11.94,49.91
SDA  (via drill 0.5)
  Top 0.254: U$44.A4 JP8.2 | U1.27 35.96,27.2 v35.69,26.92
  Top 0.305: U$44.SDA 21.34,49.53 21.08,49.28 18.16,49.28 14.86,45.97 | 14.86,45.97 R4.1 | v15.24,45.97 14.86,45.97
  Bottom 0.254: JP7.2 22.86,45.72 63.5,45.72 63.5,32.89 61.98,31.37 61.98,7.11 JP8.2 | v35.69,26.92 35.69,26.8 34.67,25.78 33.4,25.78 32,27.18 22.61,27.18 20.32,29.46 10.03,29.46 10.03,45.72
  Bottom 0.305: JP7.2 U$44.SDA | 10.03,45.72 10.29,45.97 v15.24,45.97
VCC  (via drill 0.5)
  Top 0.254: SJ1.2 22.48,7.11 21.84,7.75 21.84,14.1 | 21.84,14.1 v21.84,18.54 | LED1.A 4.41,18.92 8.26,18.92 9.4,17.78 9.4,14.86 10.16,14.1 21.84,14.1 | 2.16,45.85 2.16,18.16 2.76,17.56 | v40.39,27.69 39.5,28.57 | v29.84,25.53 29.26,26.11 C1.1
  Top 0.305: SJ_A0.1 SJ_A1.1 SJ_A2.1 SJ_A3.1 SJ_A4.1 SJ_A5.1 42.39,30.48 41.4,30.48 39.5,28.57 38.77,27.85 U1.28 | 2.16,45.85 2.29,45.97 R4.2 R3.2 | 2.76,17.56 2.79,17.53 LED1.A
  Bottom 0.254: v21.84,18.54 27.62,24.32 | v40.39,27.69 40.39,24.26 27.62,24.26 27.62,24.32 | 27.62,24.32 28.83,25.53 v29.84,25.53

### Text on the board
tPlace: & Servo Shield | 16 x 12-bit PWM | I2C Address | Uses only the SCL/SDA pins! | (Open=0/Closed=1) | GND | 1+ | A5 | A4 | A3 | A2 | A1 | A0 | +RW | C2 | V+ | 5-6V Servo / or LED Power | VCC | 0 | 1 | 2 | 3 | 4 | 5 | 6 | 7 | 8 | 9 | 10 | 11 | 12 | 13 | 14 | 15 | PWM | V+ | V+ | GND | Reset | SDA | SCL | 3V | 5V | VCC select
bPlace: PCA9685 16-Channel 12-Bit PWM Driver | 40-1000Hz | Freq.: | Use V+ for servo supply | V+: 6V Max